# Altium schematic sheet LMZ10500.SchDoc
size 431 x 279 mm; Date: Not shown in title block; ApprovedBy: Not shown in title block; CheckedBy: Not shown in title block; Author: Not shown in title block; CompanyName: Not shown in title block; DrawnBy: Andy Lin (TI); Engineer: Not shown in title block; Organization: Not shown in title block; Address1: Not shown in title block; Address2: Not shown in title block; Address3: Not shown in title block; Address4: Not shown in title block; DocumentNumber: 8; Revision: Use project parameter SCH_Rev; SheetNumber: 8; SheetTotal: 14; PageSetup: Record=PageOptions|CenterHorizontal=True|CenterVertical=True|PrintScale=1.00|XCorrection=1.00|YCorrection=1.00|PrintKind=0|BorderSize=5000000|LeftOffset=0|BottomOffset=0|Orientation=2|PaperLength=1000|PaperWidth=1000|Scale=100|PaperSource=15|PrintQuality=600|MediaType=1|DitherType=10|PaperKind=Letter|PrintScaleMode=1; CurrentTime: Not shown in title block; CurrentDate: Not shown in title block; Time: Not shown in title block; DocumentFullPathAndName: Not shown in title block; DocumentName: Not shown in title block; ModifiedDate: Not shown in title block; ImagePath: Not shown in title block
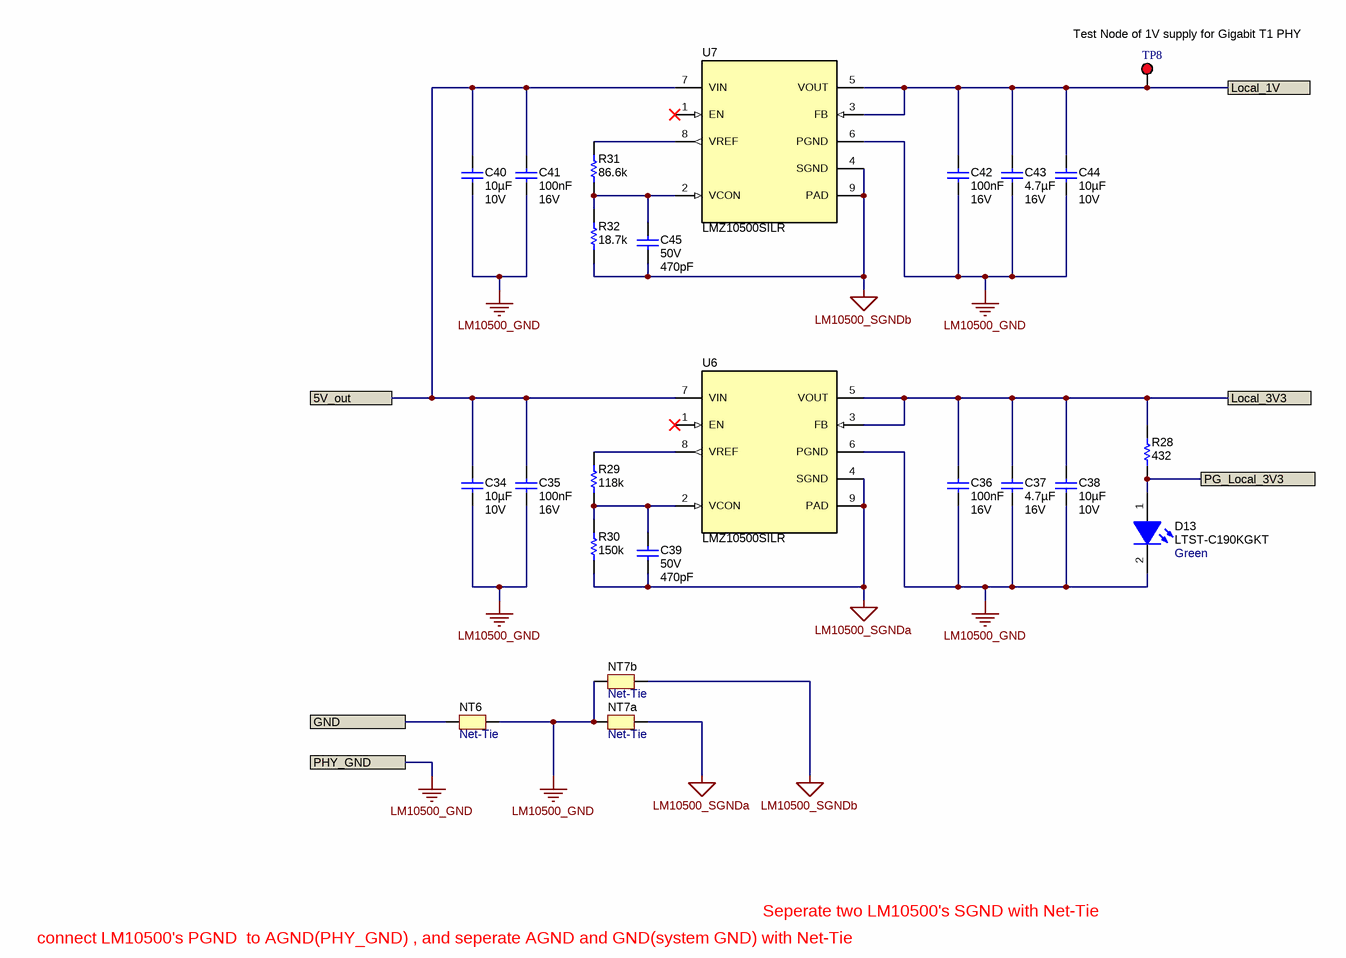
[diagram p0: LMZ10500.SchDoc]

## Parts
C34  Cap_F: 10µF  VDC_V: 10V  [0603]  (hidden comment: GRM188Z71A106MA73D)
C35  Cap_F: 100nF  VDC_V: 16V  [0603]  (hidden comment: GRM188R71C104KA01D)
C36  Cap_F: 100nF  VDC_V: 16V  [0603]  (hidden comment: GRM188R71C104KA01D)
C37  Cap_F: 4.7µF  VDC_V: 16V  [0603]  (hidden comment: GRM188Z71C475KE21D)
C38  Cap_F: 10µF  VDC_V: 10V  [0603]  (hidden comment: GRM188Z71A106MA73D)
C39  VDC_V: 50V  ValueDisplayed: 470pF  [0402]  (hidden comment: GCM155R71H471KA37D)
C40  Cap_F: 10µF  VDC_V: 10V  [0603]  (hidden comment: GRM188Z71A106MA73D)
C41  Cap_F: 100nF  VDC_V: 16V  [0603]  (hidden comment: GRM188R71C104KA01D)
C42  Cap_F: 100nF  VDC_V: 16V  [0603]  (hidden comment: GRM188R71C104KA01D)
C43  Cap_F: 4.7µF  VDC_V: 16V  [0603]  (hidden comment: GRM188Z71C475KE21D)
C44  Cap_F: 10µF  VDC_V: 10V  [0603]  (hidden comment: GRM188Z71A106MA73D)
C45  VDC_V: 50V  ValueDisplayed: 470pF  [0402]  (hidden comment: GCM155R71H471KA37D)
D13  LTST-C190KGKT  value Green  [LED_LTST-C190_G]
NT6  Net-Tie  [Net-Tie_50milWide_30milLong]  (net tie, no BOM)
NT7a  Net-Tie  [NetTie_0402]  (net tie, no BOM)
NT7b  Net-Tie  [NetTie_0402]  (net tie, no BOM)
R28  ValueDisplayed: 432  [0603]  (hidden comment: CRCW0603432RFKEA)
R29  ValueDisplayed: 118k  [0402]  (hidden comment: CRCW0402118KFKED)
R30  ValueDisplayed: 150k  [0402]  (hidden comment: CRCW0402150KFKED)
R31  ValueDisplayed: 86.6k  [0402]  (hidden comment: CRCW040286K6FKED)
R32  ValueDisplayed: 18.7k  [0402]  (hidden comment: CRCW040218K7FKED)
TP8  5000  [Keystone5000]  (value not drawn)
U6  LMZ10500SILR  [SIL0008A]
U7  LMZ10500SILR  [SIL0008A]

## Ports
5V_out, GND, Local_1V, Local_3V3, PG_Local_3V3, PHY_GND

## Nets
LM10500_GND: C34.2 C35.2 C36.2 C37.2 C38.2 C40.2 C41.2 C42.2 C43.2 C44.2 D13.2(K) NT6.2 NT7a.1 NT7b.1 U6.6(PGND) U7.6(PGND) ; port PHY_GND
LM10500_SGNDa: C39.2 NT7a.2 R30.1 U6.4(SGND) U6.9(PAD)
LM10500_SGNDb: C45.2 NT7b.2 R32.1 U7.4(SGND) U7.9(PAD)
5V_out: C34.1 C35.1 C40.1 C41.1 U6.7(VIN) U7.7(VIN) ; port 5V_out
GND: NT6.1 ; port GND
Local_1V: C42.1 C43.1 C44.1 TP8.1 U7.3(FB) U7.5(VOUT) ; port Local_1V
Local_3V3: C36.1 C37.1 C38.1 R28.2 U6.3(FB) U6.5(VOUT) ; port Local_3V3
PG_Local_3V3: D13.1(A) R28.1 ; port PG_Local_3V3
NetC39_1: C39.1 R29.1 R30.2 U6.2(VCON)
NetC45_1: C45.1 R31.1 R32.2 U7.2(VCON)
NetR29_2: R29.2 U6.8(VREF)
NetR31_2: R31.2 U7.8(VREF)

Not connected (* = marked no-connect by the designer): U6 1(EN)*; U7 1(EN)*

## Notes on the sheet
- (near TP8) Test Node of 1V supply for Gigabit T1 PHY
- connect LM10500's PGND  to AGND(PHY_GND) , and seperate AGND and GND(system GND) with Net-Tie
- Seperate two LM10500's SGND with Net-Tie
- Drawn By:
- SVN Rev:
- Number:
- TID #:
- Orderable:
- Rev:
- Sheet Title:
- File:
- Project Title:
- Designed for:
- Assembly Variant:
- Mod. Date:
- Sheet:
- Size:
- of
- B
- http://www.ti.com
- Texas Instruments and/or its licensors do not warrant the accuracy or completeness of this specification or any information contained therein. Texas Instruments and/or its licensors do not warrant that this design will meet the specifications, will be suitable for your application or fit for any particular purpose, or will operate in an implementation. Texas Instruments and/or its licensors do not warrant that the design is production worthy. You should completely validate and test your design implementation to confirm the system functionality for your application.
- Engineer:
- Contact:
- © Texas Instruments

## Library data of the parts
C34 C38 C40 C44 = CMP-0007497-5: CAP, CERM, 10 uF, 10 V, +/- 20%, X7R, 0603; Manufacturer: MuRata; TaMin_C: -55°C; Polarized: N; SizeAreaWB_mm2: 4.68; Value1: Unknown; U/M: EA; Value: 10uF; TaMax_C: 125°C; SizeZ_mm: 1; SizeX_mm: 1.6; SizeY_mm: 0.8; SizeArea_mm2: 1.28; AEC Category: Q200; Publisher: Texas Instruments; TempCo: X7R; Published: 2008-06-19; RoHS: Y; MountType: SMT; Supplier 1: Mouser; PackageReference: 0603; Tolerance_%: 20%; Cap_Case: 0603; Value2: 10V; CompType: Capacitor; LatestRevisionDate: 2017-03-09; PartNumber: GRM188Z71A106MA73D; AEC Qualified: N; ComponentLink1Description: Datasheet link; AEC Grade: N/A; Supplier Part Number 1: 81-GRM188Z71A106MA3D; Technology: Ceramic; ValueDisplayed: 10uF; ComponentLink1URL: http://psearch.en.murata.com/capacitor/product/GRM188Z71A106MA73%23.pdf
C35 C36 C41 C42 = CMP-0007378-4: CAP, CERM, 0.1 uF, 16 V, +/- 10%, X7R, 0603; Manufacturer: MuRata; TaMin_C: -55°C; Polarized: N; SizeAreaWB_mm2: 4.68; Value1: Unknown; U/M: EA; Value: 0.1uF; TaMax_C: 125°C; SizeZ_mm: 1; SizeX_mm: 1.6; SizeY_mm: 0.8; SizeArea_mm2: 1.28; AEC Category: Q200; Supplier Part Number 2: 81-GRM39X104K16; Publisher: Texas Instruments; Supplier 2: Mouser; Supplier Part Number 3: 1828890; TempCo: X7R; Supplier 3: Farnell; Published: 2008-06-19; RoHS: Y; MountType: SMT; Supplier 1: Digi-Key; PackageReference: 0603; Tolerance_%: 10%; Cap_Case: 0603; Value2: 16V; CompType: Capacitor; LatestRevisionDate: 2017-03-09; PartNumber: GRM188R71C104KA01D; AEC Qualified: ?; ComponentLink1Description: Datasheet link; Supplier Part Number 1: 490-1532-1-ND; Technology: Ceramic; ValueDisplayed: 0.1uF; ComponentLink1URL: http://search.murata.co.jp/Ceramy/PnsearchViewAction.do?HnOFG=ON&HnNFG=ON&SEL_CNT=50&sLang=en&sKey=GRM188R71C104KA01D&x=9&y=9&search=startwith
C37 C43 = CMP-0064936-4: CAP, CERM, 4.7 uF, 16 V,+/- 10%, X7R, 0603; Manufacturer: MuRata; TaMin_C: -55°C; Polarized: N; SizeAreaWB_mm2: 4.68; Value1: Unknown; U/M: EA; Value: 4.7uF; TaMax_C: 125°C; SizeZ_mm: 1; SizeX_mm: 1.6; SizeY_mm: 0.8; SizeArea_mm2: 1.28; AEC Category: Q200; Publisher: Texas Instruments; TempCo: X7R; Published: 2008-06-19; RoHS: Y; MountType: SMT; PackageReference: 0603; Tolerance_%: 10%; Cap_Case: 0603; Value2: 16V; CompType: Capacitor; LatestRevisionDate: 2017-06-05; PartNumber: GRM188Z71C475KE21D; AEC Qualified: N; ComponentLink1Description: Datasheet link; AEC Grade: N/A; Technology: Ceramic; ValueDisplayed: 4.7uF; ComponentLink1URL: http://search.murata.co.jp/Ceramy/image/img/A01X/G101/ENG/GRM188Z71C475KE21-01.pdf
C39 C45 = CMP-0006360-2: CAP, CERM, 470 pF, 50 V, +/- 10%, X7R, AEC-Q200 Grade 1, 0402; Manufacturer: MuRata; TaMin_C: -55°C; Polarized: N; SizeAreaWB_mm2: 3; Value1: Unknown; U/M: EA; Value: 470pF; TaMax_C: 125°C; SizeZ_mm: 0.6; SizeX_mm: 1; SizeY_mm: 0.5; AEC Qualified: Y; AEC Category: Q200; Supplier Part Number 2: 81-GCM155R71H471K37D; Publisher: Texas Instruments; Supplier 2: Mouser; TempCo: X7R; Published: 2008-06-19; RoHS: Y; MountType: SMT; Supplier 1: Digi-Key; PackageReference: 0402; Tolerance_%: 10%; Cap_Case: 0402; Value2: 50V; SizeArea_mm2: 0.5; CompType: Capacitor; LatestRevisionDate: 2017-03-09; PartNumber: GCM155R71H471KA37D; Cap_F: 470pF; ComponentLink1Description: Datasheet link; AEC Grade: 1; Supplier Part Number 1: 490-4913-1-ND; Technology: Ceramic; ComponentLink1URL: http://psearch.murata.com/capacitor/product/GCM155R71H471KA37%23.pdf
D13 = CMP-0002840-2: LED, Green, SMD; Manufacturer: Lite-On; Value1: W; Io_A: 30mA; Value2: 2V; Tjmax_C: 85°C; Type: AlInGaP; PartNumber: LTST-C190KGKT; MountType: SMT; CompType: LED; Color: green; ComponentLink1Description: Datasheet link; RoHS: Y; ComponentLink1URL: http://optoelectronics.liteon.com/en-us/api/DwonloadFileHandler.ashx?txtSpecNo=DS22-2000-074&txtPartNo=LTST-C190KGKT; Vf_V: 2V; PackageReference: 1.6x0.8x0.8mm
NT6 NT7a NT7b = CMP-0078142-2: Single point connection between nets.; CompType: Net-Tie; PackageReference: N/A; Library Reference: Net-Tie; Manufacturer: N/A; PartNumber: N/A; MountType: SMT
R28 = CMP-0022421-5: RES, 432, 1%, 0.1 W, AEC-Q200 Grade 0, 0603; Manufacturer: Vishay-Dale; Power_W: 100mW; TempCo: 100 ppm/C; Value_Code: 432R; Value: 432; EIA_Code: E96; SizeX_mm: 1.6; SizeY_mm: 0.8; SizeZ_mm: 1; Value2: 0.1W; SizeArea_mm2: 1.28; AEC Qualified: Y; VDC_V: 75V; AEC Category: Q200; AEC Grade: 0; Supplier Part Number 2: 52K8531; Supplier 2: Newark; Supplier Part Number 3: 71-CRCW0603-432-E3; Supplier 3: Mouser; RoHS: E; Value1: 1%; MountType: SMT; Supplier 1: Digi-Key; PackageReference: 0603; Tolerance_%: 1%; Res_ohm: 432; CompType: Resistor; PartNumber: CRCW0603432RFKEA; ComponentLink1Description: Datasheet link; Supplier Part Number 1: 541-432HCT-ND; Technology: Thick Film; ComponentLink1URL: http://www.vishay.com/docs/20035/dcrcwe3.pdf
R29 = CMP-0025973-3: RES, 118 k, 1%, 0.063 W, AEC-Q200 Grade 0, 0402; Manufacturer: Vishay-Dale; Power_W: 63mW; TempCo: 100 ppm/C; Value: 118k; EIA_Code: E96; SizeX_mm: 1; SizeY_mm: 0.5; SizeZ_mm: 0.6; Value2: 0.063W; AEC Qualified: Y; VDC_V: 50V; AEC Category: Q200; AEC Grade: 0; Supplier Part Number 2: 52K6643; Supplier 2: Newark; Supplier Part Number 3: 71-CRCW0402-118K-E3; Supplier 3: Mouser; Value_Code: 118k; RoHS: E; Value1: 1%; MountType: SMT; Supplier 1: Digi-Key; PackageReference: 0402; Tolerance_%: 1%; Res_ohm: 118k; SizeArea_mm2: 0.5; CompType: Resistor; PartNumber: CRCW0402118KFKED; ComponentLink1Description: Datasheet link; Supplier Part Number 1: 541-118KLCT-ND; Technology: Thick Film; ComponentLink1URL: http://www.vishay.com/docs/20035/dcrcwe3.pdf
R30 = CMP-0026021-3: RES, 150 k, 1%, 0.063 W, AEC-Q200 Grade 0, 0402; Manufacturer: Vishay-Dale; Power_W: 63mW; TempCo: 100 ppm/C; Value: 150k; EIA_Code: E96; SizeX_mm: 1; SizeY_mm: 0.5; SizeZ_mm: 0.6; Value2: 0.063W; AEC Qualified: Y; VDC_V: 50V; AEC Category: Q200; AEC Grade: 0; Supplier Part Number 2: 52K6719; Supplier 2: Newark; Supplier Part Number 3: 71-CRCW0402-150K-E3; Supplier 3: Mouser; Value_Code: 150k; RoHS: E; Value1: 1%; MountType: SMT; Supplier 1: Digi-Key; PackageReference: 0402; Tolerance_%: 1%; Res_ohm: 150k; SizeArea_mm2: 0.5; CompType: Resistor; PartNumber: CRCW0402150KFKED; ComponentLink1Description: Datasheet link; Supplier Part Number 1: 541-150KLCT-ND; Technology: Thick Film; ComponentLink1URL: http://www.vishay.com/docs/20035/dcrcwe3.pdf
R31 = CMP-0026582-2: RES, 86.6 k, 1%, 0.063 W, AEC-Q200 Grade 0, 0402; Manufacturer: Vishay-Dale; Power_W: 63mW; TempCo: 100 ppm/C; Value_Code: 86k6; Value: 86.6k; EIA_Code: E96; SizeX_mm: 1; SizeY_mm: 0.5; SizeZ_mm: 0.6; Value2: 0.063W; AEC Qualified: Y; VDC_V: 50V; AEC Category: Q200; AEC Grade: 0; ComponentLink1URL: http://www.vishay.com/docs/20035/dcrcwe3.pdf; Supplier Part Number 2: 52K7318; Supplier 2: Newark; Supplier Part Number 3: 71-CRCW0402-86.6K-E3; Supplier 3: Mouser; RoHS: E; Value1: 1%; MountType: SMT; Supplier 1: Digi-Key; PackageReference: 0402; Tolerance_%: 1%; Res_ohm: 86.6k; SizeArea_mm2: 0.5; CompType: Resistor; PartNumber: CRCW040286K6FKED; ComponentLink1Description: Datasheet link; Supplier Part Number 1: 541-86.6KLCT-ND; Technology: Thick Film
R32 = CMP-0026060-3: RES, 18.7 k, 1%, 0.063 W, AEC-Q200 Grade 0, 0402; Manufacturer: Vishay-Dale; Power_W: 63mW; TempCo: 100 ppm/C; Value_Code: 18k7; Value: 18.7k; EIA_Code: E96; SizeX_mm: 1; SizeY_mm: 0.5; SizeZ_mm: 0.6; Value2: 0.063W; AEC Qualified: Y; VDC_V: 50V; AEC Category: Q200; AEC Grade: 0; Supplier Part Number 2: 52K6759; Supplier 2: Newark; Supplier Part Number 3: 71-CRCW0402-18.7K-E3; Supplier 3: Mouser; RoHS: E; Value1: 1%; MountType: SMT; Supplier 1: Digi-Key; PackageReference: 0402; Tolerance_%: 1%; Res_ohm: 18.7k; SizeArea_mm2: 0.5; CompType: Resistor; PartNumber: CRCW040218K7FKED; ComponentLink1Description: Datasheet link; Supplier Part Number 1: 541-18.7KLCT-ND; Technology: Thick Film; ComponentLink1URL: http://www.vishay.com/docs/20035/dcrcwe3.pdf
TP8 = CMP-0055137-1: Test Point, Miniature, Red, TH; Manufacturer: Keystone; CNHeader: FALSE; Green_Lifecycle: Active; Green_REACh: Passed; ContactFinish: Silver; CT: TRUE; ComponentLink1URL: http://www.keyelco.com/userAssets/file/M60-2p60.pdf; Supplier Part Number 2: 534-5000; Publisher: Texas Instruments; Supplier 2: Mouser; Color: Red; RoHS: Y; MountType: TH; Green_EU RoHS-2: Incomplete; Supplier 1: Digi-Key; Green_EU RoHS: Passed; PackageReference: Red Miniature Testpoint; CompType: Test Point; LatestRevisionDate: 26/05/2017; PartNumber: 5000; ComponentLink1Description: Datasheet URL; Supplier Part Number 1: 36-5000-ND
U6 U7 = CMP-0076407-2: 2.7V to 5.5V, 650mA High Density Nano Module, SIL0008A (USIP-8); Manufacturer: Texas Instruments; Alternate PartNumber: LMZ10500SILT; SizeAreaWB_mm2: 14.4; SizeArea_mm2: 7.8; SizeZ_mm: 1.5; SizeY_mm: 3.0; CompType: IC; SizeX_mm: 2.6; AEC Category: Q200; AEC Qualified: N; ComponentLink1Description: Datasheet Link; RoHS: Y; PackageReference: SIL0008A; PartNumber: LMZ10500SILR; PackageDescription: uSIP-8; Alternate Manufacturer: Texas Instruments; ComponentLink1URL: http://www.ti.com/lit/ds/symlink/lmz10500.pdf; MountType: SMT; ComponentLink2Description: Product Folder; ComponentLink2URL: http://www.ti.com/product/lmz10500; ComponentLink3Description: Online Datasheet; ComponentLink3URL: http://www.ti.com/product/lmz10500/datasheet